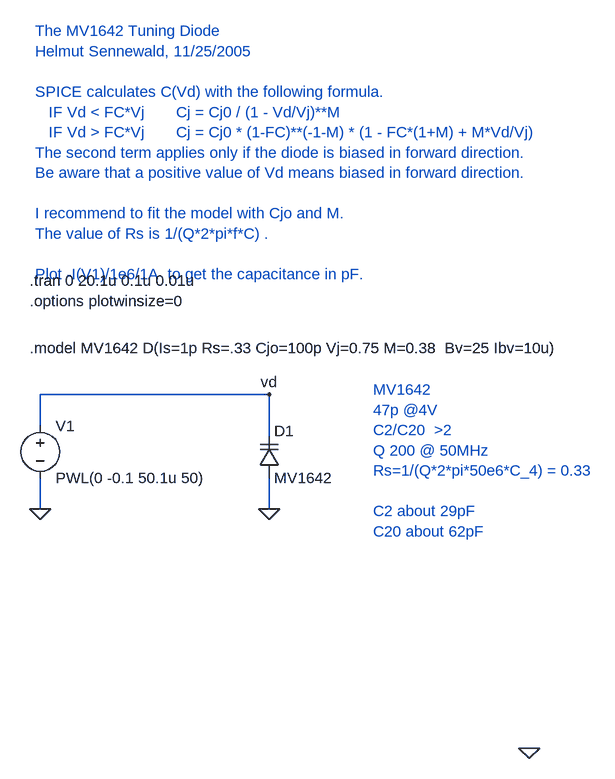
[diagram p0: schematic MV1642_test.asc]
MV1642_test.asc, the LTspice schematic file:
Version 4
SHEET 1 1668 1860
WIRE -464 256 -464 208
WIRE -464 384 -464 336
WIRE -112 208 -464 208
WIRE -112 272 -112 208
WIRE -112 384 -112 336
FLAG -464 384 0
FLAG -112 384 0
FLAG -112 208 vd
FLAG 288 752 0
SYMBOL varactor -128 336 M180
WINDOW 0 24 72 Left 0
WINDOW 3 24 0 Left 0
SYMATTR InstName D1
SYMATTR Value MV1642
SYMBOL voltage -464 240 R0
WINDOW 123 0 0 Left 0
WINDOW 39 0 0 Left 0
SYMATTR InstName V1
SYMATTR Value PWL(0 -0.1 50.1u 50)
TEXT -480 136 Left 0 !.model MV1642 D(Is=1p Rs=.33 Cjo=100p Vj=0.75 M=0.38  Bv=25 Ibv=10u)
TEXT -472 -352 Left 0 ;The MV1642 Tuning Diode\nHelmut Sennewald, 11/25/2005\n \nSPICE calculates C(Vd) with the following formula.\n   IF Vd < FC*Vj       Cj = Cj0 / (1 - Vd/Vj)**M\n   IF Vd > FC*Vj       Cj = Cj0 * (1-FC)**(-1-M) * (1 - FC*(1+M) + M*Vd/Vj)\nThe second term applies only if the diode is biased in forward direction.\nBe aware that a positive value of Vd means biased in forward direction.\n \nI recommend to fit the model with Cjo and M.\nThe value of Rs is 1/(Q*2*pi*f*C) .\n \nPlot -I(V1)/1e6/1A  to get the capacitance in pF.
TEXT -480 32 Left 0 !.tran 0 20.1u 0.1u 0.01u
TEXT 48 200 Left 0 ;MV1642\n47p @4V\nC2/C20  >2\nQ 200 @ 50MHz\nRs=1/(Q*2*pi*50e6*C_4) = 0.33\n \nC2 about 29pF\nC20 about 62pF
TEXT -480 64 Left 0 !.options plotwinsize=0

The netlist it stands for:
* MV1642_test.asc
D1 0 vd MV1642
V1 vd 0 PWL(0 -0.1 50.1u 50)
.model D D
.lib standard.dio
.model MV1642 D(Is=1p Rs=.33 Cjo=100p Vj=0.75 M=0.38  Bv=25 Ibv=10u)
* The MV1642 Tuning Diode
* Helmut Sennewald, 11/25/2005
* SPICE calculates C(Vd) with the following formula.
*    IF Vd < FC*Vj       Cj = Cj0 / (1 - Vd/Vj)**M
*    IF Vd > FC*Vj       Cj = Cj0 * (1-FC)**(-1-M) * (1 - FC*(1+M) + M*Vd/Vj)
* The second term applies only if the diode is biased in forward direction.
* Be aware that a positive value of Vd means biased in forward direction.
* I recommend to fit the model with Cjo and M.
* The value of Rs is 1/(Q*2*pi*f*C) .
* Plot -I(V1)/1e6/1A  to get the capacitance in pF.
.tran 0 20.1u 0.1u 0.01u
* MV1642
* 47p @4V
* C2/C20  >2
* Q 200 @ 50MHz
* Rs=1/(Q*2*pi*50e6*C_4) = 0.33
* C2 about 29pF
* C20 about 62pF
.options plotwinsize=0
.backanno
.end